# Altium schematic sheet BigSwitch.SchDoc
size A
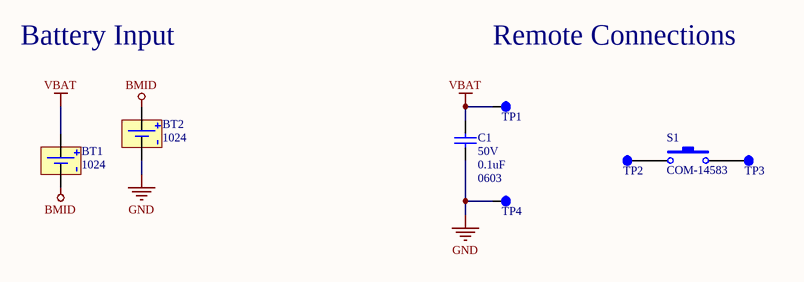
[diagram p0: BigSwitch.SchDoc]

## Parts
BT1  1024  [1024]
BT2  1024  [1024]
C1  value 0.1uF  Rated Voltage: 50V  Package: 0603  [CAPC1608X09N]  (hidden comment: Capacitor)
S1  COM-14583  [CPG151101D228]
TP1  Test Point  [TP_RECTANGULAR_1.5X2MM]  (value not drawn)
TP2  Test Point  [TP_CIRCULAR_SMD_1MM]  (value not drawn)
TP3  Test Point  [TP_CIRCULAR_SMD_1MM]  (value not drawn)
TP4  Test Point  [TP_RECTANGULAR_1.5X2MM]  (value not drawn)

## Nets
BMID: BT1.B- BT2.B+
GND: BT2.B- C1.1 TP4.1
VBAT: BT1.B+ C1.2 TP1.1
NetS1_1: S1.1 TP2.1
NetS1_2: S1.2 TP3.1

## Notes on the sheet
- Battery Input
- Remote Connections

## Library data of the parts
BT1 BT2 = 1024: HOLDER BATTERY AA SMD; Manufacturer: Keystone Electronics; Body Material: Nylon,Polypropylene; Number of Cells: 1; Wire/Cable Gauge: 26AWG; Supplier 1: Digi-Key; Manufacturer Part Number: 1024; RoHS: Yes; Category: Batteries and Accessories; Stock 1: 7804; Pricing 1: 1=2.88000, 25=2.42240, 100=2.12000, 250=2.02624, 500=1.87000, 1000=1.70001, 2500=1.46300, 5000=1.42000 (USD); Mount: Surface Mount,PCB; Material: Nylon; Contact Material: Bronze; Contact Plating: Gold; Min Operating Temperature: -50°C; Max Operating Temperature: 145°C; Package Quantity: 1; Packaging: Tray; Termination: SMD/SMT; Number of Batteries: 1; Lead Free: Lead Free; REACH SVHC: No SVHC; ComponentLink1URL: https://datasheet.ciiva.com/4642/m60p19-19340-4642624.pdf?src-supplier=Mouser; ComponentLink1Description: https://datasheet.ciiva.com/4642/m60p19-19340-4642624.pdf?src-supplier=Mouser; ComponentLink2URL: https://datasheet.ciiva.com/1437/m60p19-1437441.pdf?src-supplier=Newark; ComponentLink2Description: https://datasheet.ciiva.com/1437/m60p19-1437441.pdf?src-supplier=Newark; ComponentLink3URL: https://datasheet.ciiva.com/4/1024-4186.pdf?src-supplier=Digi-Key; ComponentLink3Description: https://datasheet.ciiva.com/4/1024-4186.pdf?src-supplier=Digi-Key
C1 = Capacitor: General purpose capacitor
S1 = COM-14583: Novelkeys Big Switch - Tactile; Manufacturer: SparkFun; Supplier 1: Digi-Key; Manufacturer Part Number: COM-14583; RoHS: No; Category: Pushbutton Switches; Stock 1: 5; Pricing 1: 1=33.75000 (USD)
TP1-TP4 = Test Point: General purpose test point